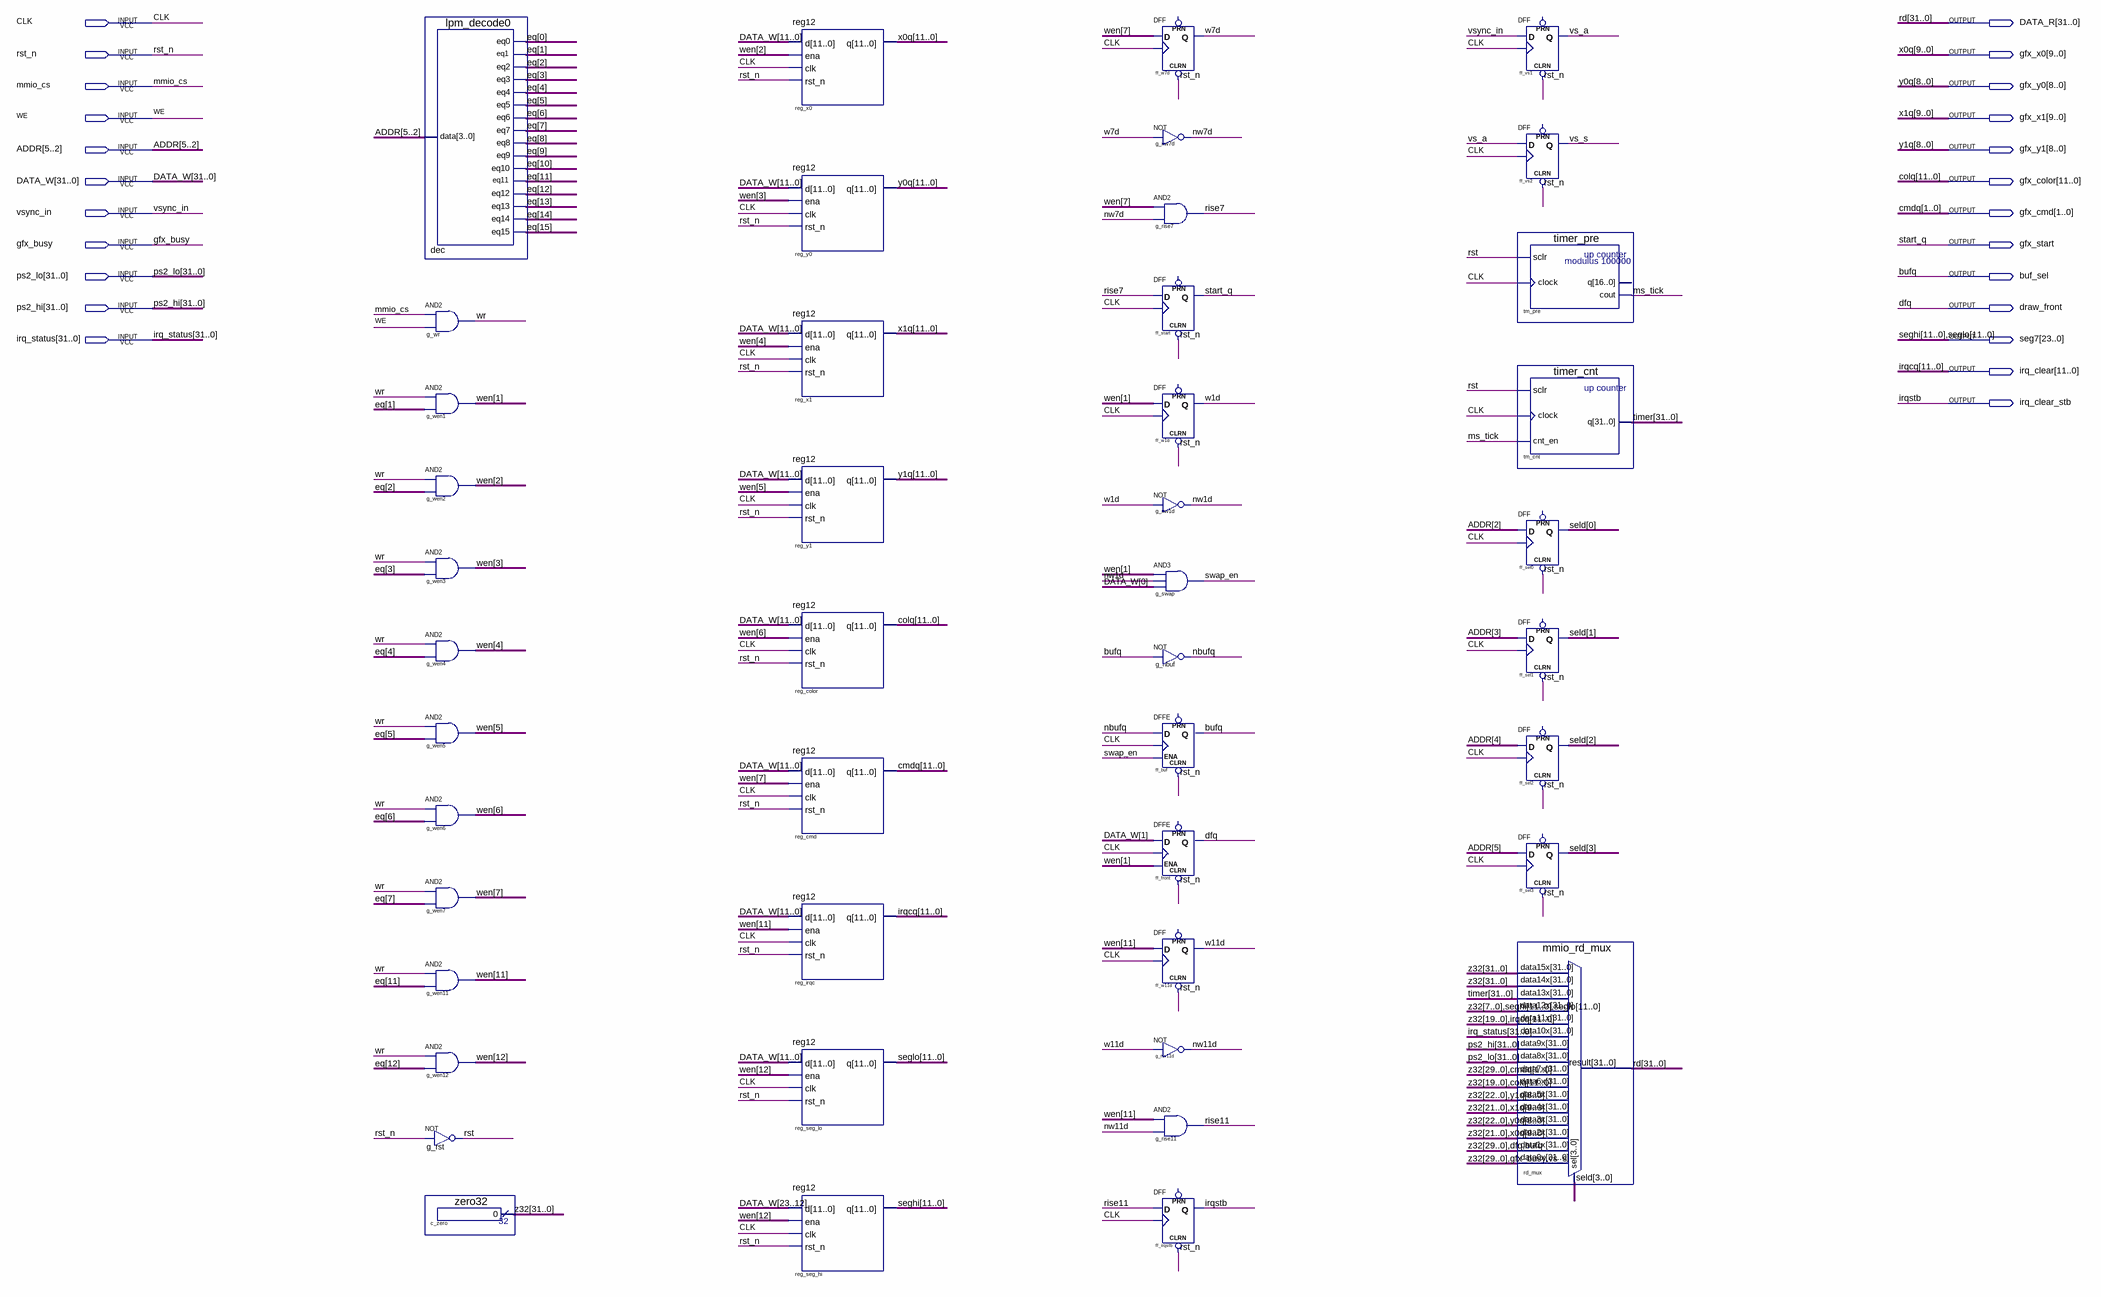
[diagram p0: schematic sheet]
// Quartus schematic mmio_regs.bdf as structural Verilog: 45 symbols, 24 pins
module mmio_regs (
  input  CLK,
  input  rst_n,
  input  mmio_cs,
  input  WE,
  input  [5:2] ADDR,
  input  [31:0] DATA_W,
  input  vsync_in,
  input  gfx_busy,
  input  [31:0] ps2_lo,
  input  [31:0] ps2_hi,
  input  [31:0] irq_status,
  output [31:0] DATA_R,
  output [9:0] gfx_x0,
  output [8:0] gfx_y0,
  output [9:0] gfx_x1,
  output [8:0] gfx_y1,
  output [11:0] gfx_color,
  output [1:0] gfx_cmd,
  output gfx_start,
  output buf_sel,
  output draw_front,
  output [23:0] seg7,
  output [11:0] irq_clear,
  output irq_clear_stb
);

  wire ms_tick, nbufq, nw1d, nw7d, nw11d, rise7, rise11, rst, swap_en, vs_a, vs_s, w1d, w7d, w11d, wr;
  wire [3:0] seld;
  wire [11:2] cmdq;
  wire [11:9] y0q, y1q;
  wire [11:10] x0q, x1q;
  wire [12:1] wen;
  wire [15:0] eq;
  wire [31:0] timer, z32;

  lpm_decode0 dec (
    .data(ADDR), .eq0(eq[0]), .eq1(eq[1]), .eq2(eq[2]), .eq3(eq[3]), .eq4(eq[4]), .eq5(eq[5]), .eq6(eq[6]),
    .eq7(eq[7]), .eq8(eq[8]), .eq9(eq[9]), .eq10(eq[10]), .eq11(eq[11]), .eq12(eq[12]), .eq13(eq[13]),
    .eq14(eq[14]), .eq15(eq[15]));
  and g_wr (wr, mmio_cs, WE);
  and g_wen1 (wen[1], wr, eq[1]);
  and g_wen2 (wen[2], wr, eq[2]);
  and g_wen3 (wen[3], wr, eq[3]);
  and g_wen4 (wen[4], wr, eq[4]);
  and g_wen5 (wen[5], wr, eq[5]);
  and g_wen6 (wen[6], wr, eq[6]);
  and g_wen7 (wen[7], wr, eq[7]);
  and g_wen11 (wen[11], wr, eq[11]);
  and g_wen12 (wen[12], wr, eq[12]);
  not g_rst (rst, rst_n);
  zero32 c_zero (.result(z32));
  reg12 reg_x0 (.d(DATA_W[11:0]), .ena(wen[2]), .clk(CLK), .rst_n(rst_n), .q({x0q, gfx_x0}));
  reg12 reg_y0 (.d(DATA_W[11:0]), .ena(wen[3]), .clk(CLK), .rst_n(rst_n), .q({y0q, gfx_y0}));
  reg12 reg_x1 (.d(DATA_W[11:0]), .ena(wen[4]), .clk(CLK), .rst_n(rst_n), .q({x1q, gfx_x1}));
  reg12 reg_y1 (.d(DATA_W[11:0]), .ena(wen[5]), .clk(CLK), .rst_n(rst_n), .q({y1q, gfx_y1}));
  reg12 reg_color (.d(DATA_W[11:0]), .ena(wen[6]), .clk(CLK), .rst_n(rst_n), .q(gfx_color));
  reg12 reg_cmd (.d(DATA_W[11:0]), .ena(wen[7]), .clk(CLK), .rst_n(rst_n), .q({cmdq, gfx_cmd}));
  reg12 reg_irqc (.d(DATA_W[11:0]), .ena(wen[11]), .clk(CLK), .rst_n(rst_n), .q(irq_clear));
  reg12 reg_seg_lo (.d(DATA_W[11:0]), .ena(wen[12]), .clk(CLK), .rst_n(rst_n), .q(seg7[11:0]));
  reg12 reg_seg_hi (.d(DATA_W[23:12]), .ena(wen[12]), .clk(CLK), .rst_n(rst_n), .q(seg7[23:12]));
  DFF ff_w7d (.CLRN(rst_n), .CLK(CLK), .D(wen[7]), .Q(w7d));  // open: PRN
  not g_nw7d (nw7d, w7d);
  and g_rise7 (rise7, wen[7], nw7d);
  DFF ff_start (.CLRN(rst_n), .CLK(CLK), .D(rise7), .Q(gfx_start));  // open: PRN
  DFF ff_w1d (.CLRN(rst_n), .CLK(CLK), .D(wen[1]), .Q(w1d));  // open: PRN
  not g_nw1d (nw1d, w1d);
  and g_swap (swap_en, wen[1], nw1d, DATA_W[0]);
  not g_nbuf (nbufq, buf_sel);
  DFFE ff_buf (.CLRN(rst_n), .D(nbufq), .CLK(CLK), .ENA(swap_en), .Q(buf_sel));  // open: PRN
  DFFE ff_front (.CLRN(rst_n), .D(DATA_W[1]), .CLK(CLK), .ENA(wen[1]), .Q(draw_front));  // open: PRN
  DFF ff_w11d (.CLRN(rst_n), .CLK(CLK), .D(wen[11]), .Q(w11d));  // open: PRN
  not g_nw11d (nw11d, w11d);
  and g_rise11 (rise11, wen[11], nw11d);
  DFF ff_irqstb (.CLRN(rst_n), .CLK(CLK), .D(rise11), .Q(irq_clear_stb));  // open: PRN
  DFF ff_vs1 (.CLRN(rst_n), .CLK(CLK), .D(vsync_in), .Q(vs_a));  // open: PRN
  DFF ff_vs2 (.CLRN(rst_n), .CLK(CLK), .D(vs_a), .Q(vs_s));  // open: PRN
  timer_pre tm_pre (.sclr(rst), .clock(CLK), .cout(ms_tick));  // open: q
  timer_cnt tm_cnt (.sclr(rst), .clock(CLK), .cnt_en(ms_tick), .q(timer));
  DFF ff_sel0 (.CLRN(rst_n), .CLK(CLK), .D(ADDR[2]), .Q(seld[0]));  // open: PRN
  DFF ff_sel1 (.CLRN(rst_n), .CLK(CLK), .D(ADDR[3]), .Q(seld[1]));  // open: PRN
  DFF ff_sel2 (.CLRN(rst_n), .CLK(CLK), .D(ADDR[4]), .Q(seld[2]));  // open: PRN
  DFF ff_sel3 (.CLRN(rst_n), .CLK(CLK), .D(ADDR[5]), .Q(seld[3]));  // open: PRN
  mmio_rd_mux rd_mux (
    .data15x(z32), .data14x(z32), .data13x(timer), .data12x({z32[7:0], seg7}),
    .data11x({z32[19:0], irq_clear}), .data10x(irq_status), .data9x(ps2_hi), .data8x(ps2_lo),
    .data7x({z32[29:0], gfx_cmd}), .data6x({z32[19:0], gfx_color}), .data5x({z32[22:0], gfx_y1}),
    .data4x({z32[21:0], gfx_x1}), .data3x({z32[22:0], gfx_y0}), .data2x({z32[21:0], gfx_x0}),
    .data1x({z32[29:0], draw_front, buf_sel}), .data0x({z32[29:0], gfx_busy, vs_s}), .sel(seld),
    .result(DATA_R));

  // Other names for the same wires on the sheet: bufq = buf_sel; cmdq[1:0] = gfx_cmd; colq[11:0] = gfx_color;
  //   dfq = draw_front; irqcq[11:0] = irq_clear; irqstb = irq_clear_stb; rd[31:0] = DATA_R; seghi[11:0] = seg7[23:12];
  //   seglo[11:0] = seg7[11:0]; start_q = gfx_start; x0q[9:0] = gfx_x0; x1q[9:0] = gfx_x1; y0q[8:0] = gfx_y0;
  //   y1q[8:0] = gfx_y1
endmodule
